# Altium project JBC_SolderingIron.PrjPcb
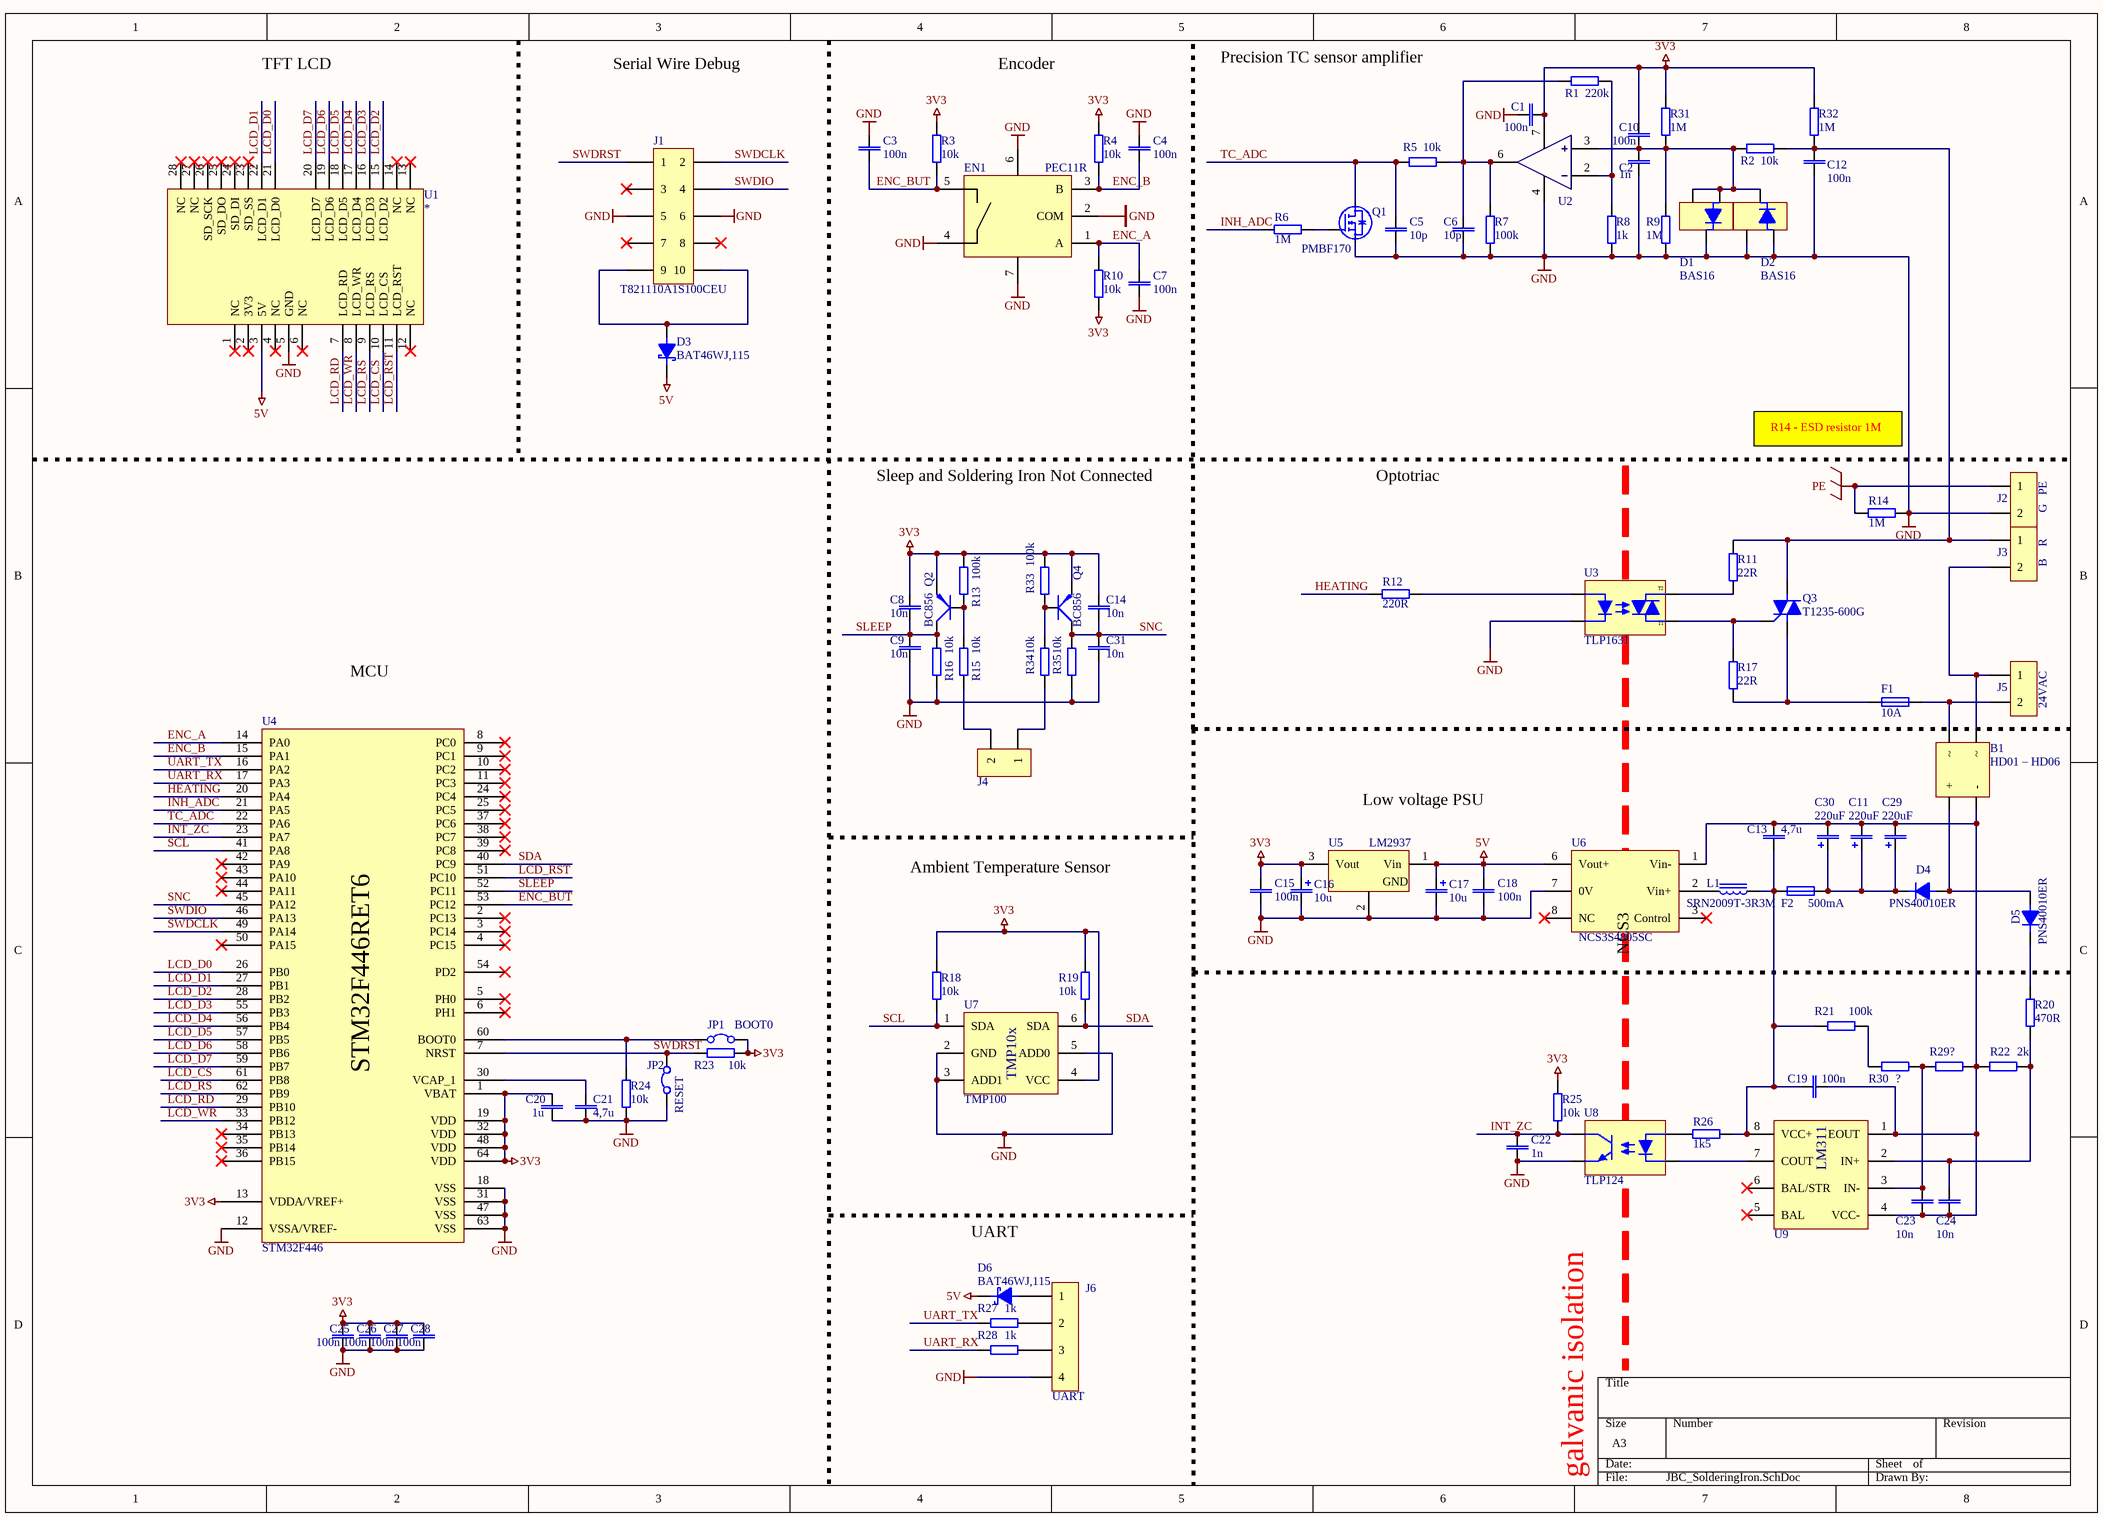
[diagram p0: JBC_SolderingIron.SchDoc]
1 sheet, 98 parts. Net scope: global (net labels, ports and power ports of the same name join across sheets).
Board file: JBC_SolderingIron.PcbDoc

## Sheet JBC_SolderingIron.SchDoc
size A3

### Parts
B1  HD01 – HD06  [HD01–HD06]
C1  100n  [CAP 0805]
C2  1n  [CAP 0805]
C3  100n  [CAP 0805]
C4  100n  [CAP 0805]
C5  10p  [CAP 0805]
C6  10p  [CAP 0805]
C7  100n  [CAP 0805]
C8  10n  [CAP 0805]
C9  10n  [CAP 0805]
C10  100n  [CAP 0805]
C11  220uF  [G ELKO]
C12  100n  [CAP 0805]
C13  4,7u  [CAP 0805]
C14  10n  [CAP 0805]
C15  100n  [CAP 0805]
C16  10u  [CAP 1210]
C17  10u  [CAP 1210]
C18  100n  [CAP 0805]
C19  100n  [CAP 0805]
C20  1u  [CAP 0805]
C21  4,7u  [CAP 0805]
C22  1n  [CAP 0805]
C23  10n  [CAP 0805]
C24  10n  [CAP 0805]
C25  100n  [CAP 0805]
C26  100n  [CAP 0805]
C27  100n  [CAP 0805]
C28  100n  [CAP 0805]
C29  220uF  [G ELKO]
C30  220uF  [G ELKO]
C31  10n  [CAP 0805]
D1  BAS16  [SOT23]
D2  BAS16  [SOT23]
D3  BAT46WJ,115  [SOD-123]
D4  PNS40010ER  [SOD-123]
D5  PNS40010ER  [SOD-123]
D6  BAT46WJ,115  [SOD-123]
EN1  PEC11R  [PEC11]
F1  10A  [FUSE_WE5x20]
F2  500mA  [FUSE1812]
J1  T821110A1S100CEU  [MLW10]
J2  G   PE  [PTR_AKZ350]
J3  B    R  [PTR_AKZ350]
J4  (no value)  [SIL2]
J5  24VAC  [PTR_AKZ350]
J6  UART  [SIL4]
JP1  BOOT0  [SIL2]
JP2  RESET  [SIL2]
L1  SRN2009T-3R3M  [SRN2009T]
Q1  PMBF170  [SOT23]
Q2  BC856  [SOT23]
Q3  T1235-600G  [TO262]
Q4  BC856  [SOT23]
R1  220k  [RES 0805]
R2  10k  [RES 0805]
R3  10k  [RES 0805]
R4  10k  [RES 0805]
R5  10k  [RES 0805]
R6  1M  [RES 0805]
R7  100k  [RES 0805]
R8  1k  [RES 0805]
R9  1M  [RES 0805]
R10  10k  [RES 0805]
R11  22R  [RES 0805]
R12  220R  [RES 0805]
R13  100k  [RES 0805]
R14  1M  [RES 0805]
R15  10k  [RES 0805]
R16  10k  [RES 0805]
R17  22R  [RES 0805]
R18  10k  [RES 0805]
R19  10k  [RES 0805]
R20  470R  [RES 0805]
R21  100k  [RES 0805]
R22  2k  [RES 0805]
R23  10k  [RES 0805]
R24  10k  [RES 0805]
R25  10k  [RES 0805]
R26  1k5  [RES 0805]
R27  1k  [RES 0805]
R28  1k  [RES 0805]
R29  ?  [RES 0805]
R30  ?  [RES 0805]
R31  1M  [RES 0805]
R32  1M  [RES 0805]
R33  100k  [RES 0805]
R34  10k  [RES 0805]
R35  10k  [RES 0805]
U1  *  [2.8inch_TFTLCD]
U2  OPA335AID  [SO8]  (value not drawn)
U3  TLP163J  [11-4C1]
U4  STM32F446  [LQFP64]
U5  LM2937  [SOT223]
U6  NCS3S4805SC  [NCS3]
U7  TMP100  [SOT-23-6L]
U8  TLP124  [11-4C1]
U9  LM311D  [SO8]  (value not drawn)

### Nets
3V3: C1.2 C8.1 C10.1 C14.1 C15.1 C16.1(+) C20.1 C25.2 C26.2 C27.2 C28.2 JP1.2 Q2.2(E) Q4.2(E) R3.2 R4.2 R10.1 R13.1 R18.2 R19.2 R23.2 R25.1 R31.2 R32.2 R33.1 U2.7(V+) U4.1(VBAT) U4.13(VDDA/VREF+) U4.19(VDD) U4.32(VDD) U4.48(VDD) U4.64(VDD) U5.3(Vout) U7.4(VCC)
5V: C17.1(+) C18.1 D3.2(K) D6.2(K) U1.3(5V) U5.1(Vin) U6.6(Vout+)
GND: C1.1 C2.2 C3.1 C4.1 C5.2 C6.2 C7.2 C9.2 C12.1 C15.2 C16.2(-) C17.2(-) C18.2 C20.2 C21.1 C22.2 C25.1 C26.1 C27.1 C28.1 C31.2 D1.3(K) D2.1(A) D2.2(NC) EN1.2(COM) EN1.4 EN1.6 EN1.7 J1.5 J1.6 J2.2 J6.4 JP2.1 Q1.2(S) R7.1 R8.1 R9.1 R14.2 R16.2 R24.1 R35.2 U1.5(GND) U2.4(V-) U3.3(K) U4.12(VSSA/VREF-) U4.18(VSS) U4.31(VSS) U4.47(VSS) U4.63(VSS) U5.2(GND) U6.7(0V) U7.2(GND) U7.3(ADD1) U7.5(ADD0) U8.4(E)
PE: J2.1 R14.1
ENC_A: C7.1 EN1.1(A) R10.2 U4.14(PA0)
ENC_B: C4.2 EN1.3(B) R4.1 U4.15(PA1)
ENC_BUT: C3.2 EN1.5 R3.1 U4.53(PC12)
HEATING: R12.2 U4.20(PA4)
INH_ADC: R6.2 U4.21(PA5)
INT_ZC: C22.1 R25.2 U4.23(PA7) U8.6(C)
LCD_CS: U1.10(LCD_CS) U4.61(PB8)
LCD_D0: U1.21(LCD_D0) U4.26(PB0)
LCD_D1: U1.22(LCD_D1) U4.27(PB1)
LCD_D2: U1.15(LCD_D2) U4.28(PB2)
LCD_D3: U1.16(LCD_D3) U4.55(PB3)
LCD_D4: U1.17(LCD_D4) U4.56(PB4)
LCD_D5: U1.18(LCD_D5) U4.57(PB5)
LCD_D6: U1.19(LCD_D6) U4.58(PB6)
LCD_D7: U1.20(LCD_D7) U4.59(PB7)
LCD_RD: U1.7(LCD_RD) U4.29(PB10)
LCD_RS: U1.9(LCD_RS) U4.62(PB9)
LCD_RST: U1.11(LCD_RST) U4.51(PC10)
LCD_WR: U1.8(LCD_WR) U4.33(PB12)
SCL: R18.1 U4.41(PA8) U7.1(SDA)
SDA: R19.1 U4.40(PC9) U7.6(SDA)
SLEEP: C8.2 C9.1 Q2.3(C) R16.1 U4.52(PC11)
SNC: C14.2 C31.1 Q4.3(C) R35.1 U4.45(PA12)
SWDCLK: J1.2 U4.49(PA14)
SWDIO: J1.4 U4.46(PA13)
SWDRST: J1.1 JP2.2 R23.1 U4.7(NRST)
TC_ADC: C5.1 Q1.3(D) R5.2 U4.22(PA6)
UART_RX: R28.2 U4.17(PA3)
UART_TX: R27.2 U4.16(PA2)
NetB1_1: B1.1(+) D4.1(A) D5.1(A)
NetB1_2: B1.2(-) C11.2(-) C13.1 C19.2 C23.2 C24.1 C29.2(-) C30.2(-) R22.1 R29.1 U6.1(Vin-) U9.1(EOUT) U9.4(VCC-)
NetB1_3: B1.3 J3.2 J5.1
NetB1_4: B1.4 F1.2 J5.2
NetC2_1: C2.1 C10.2 D1.1(A) D1.2(NC) D2.3(K) R2.1 R9.2 R31.1 U2.3(+In)
NetC6_1: C6.1 R1.2 R5.1 R7.2 U2.6(OUT)
NetC11_1: C11.1(+) C29.1(+) C30.1(+) D4.2(K) F2.2
NetC12_2: C12.2 J3.1 Q3.2(A2) R2.2 R11.1 R32.1
NetC13_2: C13.2 C19.1 F2.1 L1.1 R21.2 R26.1 U9.8(VCC+)
NetC21_2: C21.2 U4.30(VCAP_1)
NetC23_1: C23.1 R29.2 R30.1 U9.3(IN-)
NetC24_2: C24.2 R20.1 R22.2 U9.2(IN+)
NetD3_1: D3.1(A) J1.9 J1.10
NetD5_2: D5.2(K) R20.2
NetD6_1: D6.1(A) J6.1
NetF1_1: F1.1 Q3.1(A1) R17.1
NetJ4_1: J4.1 R34.2
NetJ4_2: J4.2 R15.2
NetJ6_2: J6.2 R27.1
NetJ6_3: J6.3 R28.1
NetJP1_1: JP1.1 R24.2 U4.60(BOOT0)
NetL1_2: L1.2 U6.2(Vin+)
NetQ1_1: Q1.1(G) R6.1
NetQ2_1: Q2.1(B) R13.2 R15.1
NetQ3_3: Q3.3(G) R17.2 U3.4(T1)
NetQ4_1: Q4.1(B) R33.2 R34.1
NetR1_1: R1.1 R8.2 U2.2(-In)
NetR11_2: R11.2 U3.6(T2)
NetR12_1: R12.1 U3.1(A)
NetR21_1: R21.1 R30.2
NetR26_2: R26.2 U8.1(A)
NetU8_3: U8.3(K) U9.7(COUT)

Not connected (* = marked no-connect by the designer): J1 3* 7* 8*; U1 1(NC)* 2(3V3)* 4(NC)* 6(NC)* 12(NC)* 13(NC)* 14(NC)* 23(SD_SS)* 24(SD_DI)* 25(SD_DO)* 26(SD_SCK)* 27(NC)* 28(NC)*; U4 2(PC13)* 3(PC14)* 4(PC15)* 5(PH0)* 6(PH1)* 8(PC0)* 9(PC1)* 10(PC2)* 11(PC3)* 24(PC4)* 25(PC5)* 34(PB13)* 35(PB14)* 36(PB15)* 37(PC6)* 38(PC7)* 39(PC8)* 42(PA9)* 43(PA10)* 44(PA11)* 50(PA15)* 54(PD2)*; U6 3(Control)* 8(NC)*; U9 5(BAL)* 6(BAL/STR)*

### Notes on the sheet
- TFT LCD
- Serial Wire Debug
- Encoder
- Precision TC sensor amplifier
- R14 - ESD resistor 1M
- Sleep and Soldering Iron Not Connected
- Optotriac
- MCU
- Low voltage PSU
- Ambient Temperature Sensor
- UART
- (near U8) galvanic isolation

### Library data of the parts
B1 = HD01–HD06: 0.8A SURFACE MOUNT GLASS PASSIVATED BRIDGE RECTIFIER; Manufacturer: DiodesZetex; Reference ID: 751-4458; Name: HD01 – HD06; Distributor: RS Components
C1-C10 C12-C15 C18-C28 C31 = CAP: NON POLARIZED CAPACITOR; REFERENCE ID: *; DISTRIBUTOR: *
  C1 C3 C4 C7 C10 C12 C15 C18 C19 C25-C28: VALUE: 100n
  C2 C22: VALUE: 1n
  C5 C6: VALUE: 10p
  C8 C9 C14 C23 C24 C31: VALUE: 10n
  C13 C21: VALUE: 4,7u
  C20: VALUE: 1u
C11 C16 C17 C29 C30 = CAP_POL: POLARIZED CAPACITOR; Reference ID: *; Distributor: *; Name: *; Manufacture: *
  C11 C29 C30: Value: 220uF
  C16 C17: Value: 10u
D1 D2 = BAS16: Low leakage current diode; Manufacturer: ON Semiconductor; Reference ID: 739-0476; Name: BAS16; Value: BAS16; Distributor: RS Components
D3 D6 = SCHOTTKY: SCHOTTKY DIODE; Manufacturer: Nexperia; Reference ID: 780-5350; Value: BAT46WJ,115; Name: BAT46WJ; Distributor: RS Components
D4 D5 = PNS40010ER: Nexperia PNS40010ER,115 switching diode 1.4A, 400V, SOD-123; Reference ID: 136-4874; Name: PNS40010ER; Value: PNS40010ER,115; Manufacturer: Nexperia; Distributor: RS Components
EN1 = PEC11: Mechanical rotary encoder with pushbutton; Manufacturer: Bourns; Reference ID: 789-9541; Value: PEC11R-4215K-N0024; Name: PEC11R; Distributor: RS Components
F1 = FUSE_WE5x20: Wurth Elektronik PCB Fuse Holder, 10 (UL) A, 6.3 (VDE) A, 250V ac; Reference ID: 893-0580; Name: 696107003002; Value: 10A; Distributor: RS Components; Manufacturer: Wurth Elektronik
F2 = FUSE: REFERENCE ID: 44-02-32; VALUE: 500mA; DISTRIBUTOR: LOMEX
J1 = T821-10: T821, 10pin, 2x5 connector, 2.54mm; Manufacturer: Amphenol; Reference ID: 832-3528; Value: T821110A1S100CEU; Name: T821; Distributor: RS Components
J2-J5 = TB-2: 2 Pin Terminal Block; Manufacturer: TE Connectivity; Reference ID: 710-0100; Value: 282837-2; Distributor: RS Components
  J2: Name: G   PE
  J3: Name: B    R
  J5: Name: 24VAC
J6 = HEADER4: 4 PIN HEADER; Value: UART; Name: *; Distributor: *; Reference ID: *; Manufacturer: *
JP1 JP2 = JUMPER
  JP1: Name: BOOT0
  JP2: Name: RESET
L1 = SRN2009T-3R3M: SRN2009T-3R3M -  Power Inductor (SMD), 3.3 µH, 850 mA, Semishielded, 850 mA, SRN2009T Series, 2mm x 1.6mm x 0.95mm; Manufacturer: Bourns; Name: 3.3uH; Reference ID: 2808273; Value: SRN2009T-3R3M; Distributor: Farnell
Q1 = PMBF170: N-Channel MOSFET; Manufacturer: Nexperia; Reference ID: 484-3536; Value: PMBF170,215; Distributor: RS Components; Name: PMBF170
Q2 Q4 = BC856: PNP transistor, SOT23; Manufacturer: ON Semiconductor; Reference ID: 781-5109; Value: NSVBC858CLT1G; Name: BC856; Distributor: RS Components
Q3 = T1235-600G: ST micro T1235-600G triac; Manufacturer: ST Microelectronics; Reference ID: 811-1111; Name: T1235-600G; Distributor: RS Components
R1-R35 = RES: RESISTOR; REFERENCE ID: *; DISTRIBUTOR: *
  R1: VALUE: 220k
  R2-R5 R10 R15 R16 R18 R19 R23-R25 R34 R35: VALUE: 10k
  R6 R9 R14 R31 R32: VALUE: 1M
  R7 R13 R21 R33: VALUE: 100k
  R8 R27 R28: VALUE: 1k
  R11 R17: VALUE: 22R
  R12: VALUE: 220R
  R20: VALUE: 470R
  R22: VALUE: 2k
  R26: VALUE: 1k5
  R29 R30: VALUE: ?
U1 = 2.8inch_TFT_LCD: 2.8 inch Adafruit LCD module; Name: *; Distributor: *; Reference ID: *; Value: *; Manufacturer: *
U2 = OPA335: Precision OPAMP, SO8; Manufacturer: Texas Instruments; Reference ID: 461-8699; Value: OPA335AID; Name: OPA335; Distributor: RS Components
U3 = TLP168J: Toshiba TLP163J optotriac with zero crossing detector; Reference ID: 885-1326; Name: TLP163J; Distributor: RS Components; Manufacturer: Toshiba
U4 = STM32F446RET6: MCU STM32F446RET6 32bit, ARM Cortex M4, 180MHz, Flash, 128 kB RAM, 2xUSB USB, LQFP-64; Manufacturer: ST Microelectronics; Reference ID: 110-6621; Name: STM32F446; Value: STM32F446RET6; Distributor: RS Components
U5 = LM2937: LDO-regulator 400mA 3,3 V 5%, 4,75 → 26 V, SOT223; Manufacturer: Texas Instruments; Reference ID: 761-5599; Value: LM2937IMP-3.3/NOPB; Distributor: RS Components; Name: LM2937
U6 = NCS3: NCS3-SINGLE DC/DC; Manufacturer: muRata; Reference ID: 876-2462; Name: NCS3; Distributor: RS Components; Value: NCS3S4805SC
U7 = TMP10x: Temperature sensor with I2C interface; Manufacturer: Texas Instruments; Distributor: *; Name: TMP100; Reference ID: *; Value: TMP100
U8 = TLP124: Transistor output optocoupler TOSHIBA TLP124; Reference ID: 760-3158; Name: TLP124; Distributor: RS Components; Manufacturer: Toshiba
U9 = LM311: LM311D -  SINGLE CHANNEL W/STROBE COMPARATOR, SO8; Manufacturer: Texas Instruments; Reference ID: 3005521; Value: LM311D; Name: LM311D; Distributor: Farnell